# Altium schematic sheet Relay.SchDoc
size A4; DrawnBy: Craig Comberbach; DocumentNumber: 4; Revision: A1; SheetNumber: 4; SheetTotal: 7
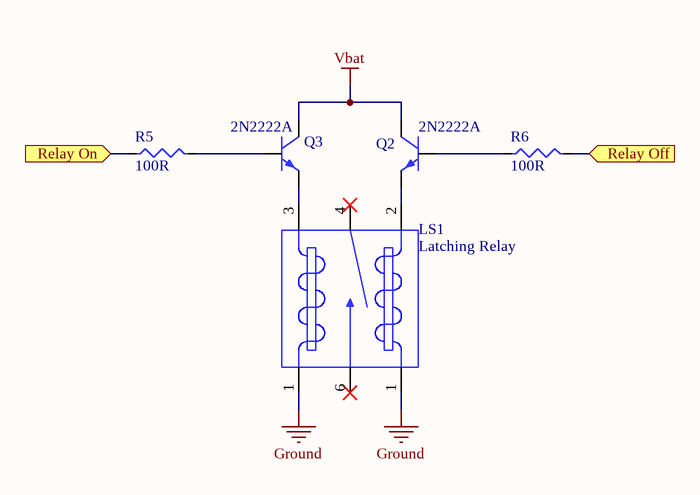
[diagram p0: Relay.SchDoc]

## Parts
LS1  QuickValue: Latching Relay  (hidden comment: Relay SPST, Latching)
Q2  QuickValue: 2N2222A  (hidden comment: Transistor - NPN BJT)
Q3  QuickValue: 2N2222A  (hidden comment: Transistor - NPN BJT)
R5  QuickValue: 100R  [RESISTOR THT 5W 0.05HOLE 900MIL]  (hidden comment: Resistor)
R6  QuickValue: 100R  [RESISTOR THT 5W 0.05HOLE 900MIL]  (hidden comment: Resistor)

## Ports
Relay Off (in), Relay On (in)

## Nets
4: LS1.5
6: LS1.7
Ground: LS1.1
Vbat: Q2.2(Collector) Q3.2(Collector)
Relay Off: R6.2 ; port Relay Off
Relay On: R5.1 ; port Relay On
NetLS1_2: LS1.2 Q2.3(Emitter)
NetLS1_3: LS1.3 Q3.3(Emitter)
NetQ2_1: Q2.1(Base) R6.1
NetQ3_1: Q3.1(Base) R5.2

Not connected (* = marked no-connect by the designer): LS1 4* 6*

## Library data of the parts
Q2 Q3 = Transistor - NPN BJT: NPN BJT Transistor; Value: 2N2222A; Technology: THT; Supplier 1: Digi-Key; Supplier Part Number 1: P2N2222AGOS-ND; Package: TO92-3
R5 R6 = Resistor: Value: 100R 1/4W 1%; Tolerance: 1%; Technology: THT; Supplier 1: Digi-Key; Supplier Part Number 1: 100XBK-ND; Package: 1/4W
LS1 = Relay SPST, Latching: Value: Relay; Supplier 1: Digi-Key; Supplier Part Number 1: 255-1442-ND; Technology: THT; Package: Relay